# EAGLE design v7-flex2811_single (EAGLE 7.3.0)
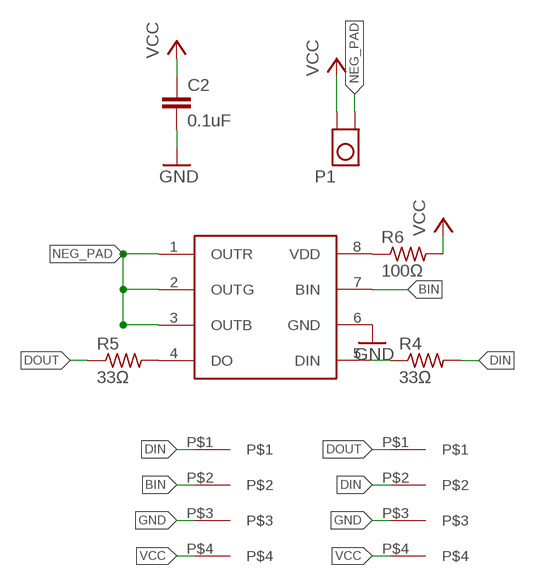
[diagram p0: schematic, sheet 1]

## Parts
C2  0.1uF  C-EUC0201  [C0201]
P1  TP_4MM_MED_PAD  [TP_4MM_MED_PAD]
R4  33Ω  R-US_R0201  [R0201]
R5  33Ω  R-US_R0201  [R0201]
R6  100Ω  R-US_R0201  [R0201]
U1  WS2818  [SO08]
U$3  4PAD  [4PAD]
U$4  4PAD  [4PAD]

## Nets
BIN: U1.7(BIN) U$3.P$2
DIN: R4.2 U$3.P$1 U$4.P$2
DOUT: R5.1 U$4.P$1
GND: C2.2 U1.6(GND) U$3.P$3 U$4.P$3
N$4: R4.1 U1.5(DIN)
N$5: R5.2 U1.4(DO)
N$6: R6.1 U1.8(VDD)
NEG_PAD: P1.P$1 U1.1(OUTR) U1.2(OUTG) U1.3(OUTB)
VCC: C2.1 P1.P$2 R6.2 U$3.P$4 U$4.P$4

## Library data of the parts
C2 = rcl:C-EU: CAPACITOR, European symbol
P1 = tom-tappytap-v5-flex:TP_4MM_MED_PAD
R4-R6 = rcl:R-US_: RESISTOR, American symbol
U1 = Sparky:WS2818
U$3 U$4 = Sparky:4PAD

## Board
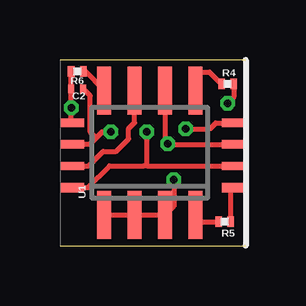
[diagram p1: board, top side]
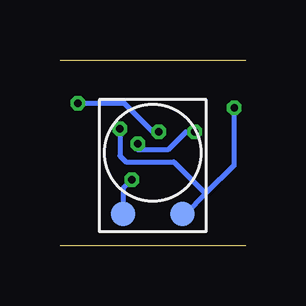
[diagram p2: board, bottom side, seen from below]

Size 7.75 x 7.75 mm. Coordinates in mm from the lower left corner, seen from the top.
Outline: 0,0 7.75,0
Outline: 7.75,7.75 0,7.75
Copper layers (1*16): Top 0.035mm / dielectric 1.5mm / Bottom 0.035mm
Design rules "PCBWayMin *": minimum track width 6mil, minimum drill 0.3mm, track to track 6mil, track to pad 6mil, pad to pad 6mil, via to via 6mil, smd to smd 0mil, copper to edge 10mil, drill to drill 8mil, minimum pad ring 10mil, minimum via ring 6mil, stop-mask expansion 4mil, vias tented up to drill 25mil, thermal gap 10mil

### Footprints (pad centres in the part's own frame; a part is rotated, then mirrored left to right if it is on the bottom)
C0201 = smd 0.25 x 0.35: 1 -0.25,0; 2 0.25,0
TP_4MM_MED_PAD = smd 1.016 x 1.016: P$1 -1.24,-2.55; P$2 1.24,-2.55
R0201 = smd 0.28 x 0.43: 1 -0.255,0; 2 0.255,0
SO08 = smd 0.6 x 2: 1 -1.905,-2.6; 2 -0.635,-2.6; 3 0.635,-2.6; 4 1.905,-2.6; 5 1.905,2.6; 6 0.635,2.6; 7 -0.635,2.6; 8 -1.905,2.6
4PAD = smd 1 x 0.4: P$1 0,0.3 | smd 1 x 0.35: P$2 0,1.2; P$3 0,2.1; P$4 0,3

### Placement (x,y rotation side)
C2  0.72,6.55 0 top
P1  3.88,3.88 0 bottom
R4  7,6.75 0 top
R5  6.88,1 180 top
R6  0.72,7.28 180 top
U1  3.75,3.88 0 top
U$3  0.5,2.12 0 top
U$4  7.25,2.12 0 top

### Tracks (layer width: path | path; a pad name or v marks a point on that pad's centre or on a via)
BIN
  Top 0.2: U$3.P$2 1.2,3.33 1.8,3.93 2.35,3.93 2.87,4.45 2.87,4.89 3.12,5.13 U1.7
DIN  (via drill 0.3)
  Top 0.2: 3.62,3.33 v3.62,4.75 | R4.2 7.25,6.2 v7,5.94 | U$3.P$1 1.17,2.42 2.06,3.33 3.5,3.33 3.62,3.33 | 3.62,3.33 U$4.P$2
  Bottom 0.2: v3.62,4.75 3.88,4.75 5.07,5.94 v7,5.94
DOUT
  Top 0.2: R5.1 7.13,2.31 U$4.P$1
GND  (via drill 0.3)
  Top 0.2: U1.6 4.38,4.37 v4.5,4.25 4.53,4.22 U$4.P$3 7.22,4.25 | U$3.P$3 0.85,4.22 0.88,4.25 1.25,4.25 1.5,4.5 | 1.5,4.5 1.75,4.75 v2.12,4.75 | 1.5,4.5 1.27,4.73 1.27,6.25 C2.2
  Bottom 0.2: v4.5,4.25 4.5,4 3.25,4 2.5,4.75 v2.12,4.75
N$4
  Top 0.2: 5.66,6.78 U1.5 5.62,6.5 5.62,7 5.88,7.25 6.25,7.25 R4.1
N$5
  Top 0.2: U1.4 5.93,1 R5.2
N$6
  Top 0.2: 1.84,6.78 U1.8 1.04,7.28 R6.1
NEG_PAD  (via drill 0.3)
  Top 0.2: U1.1 U1.2 U1.3 4.75,1.64 v4.75,2.75
  Bottom 0.2: v4.75,2.75 5.12,2.38 P1.P$1
VCC  (via drill 0.3)
  Top 0.2: v5.25,4.88 6.25,4.88 6.5,5.12 U$4.P$4 | U$3.P$4 0.47,5.15 v0.47,5.75 C2.1 0.47,6.66 R6.2
  Bottom 0.2: v5.25,4.88 5.25,3.75 5,3.5 3,3.5 1.67,2.17 | v0.47,5.75 0.47,3.36 1.67,2.17 | 1.67,2.17 2.51,1.32 P1.P$2